# EAGLE design M606A (EAGLE 6.6.0)
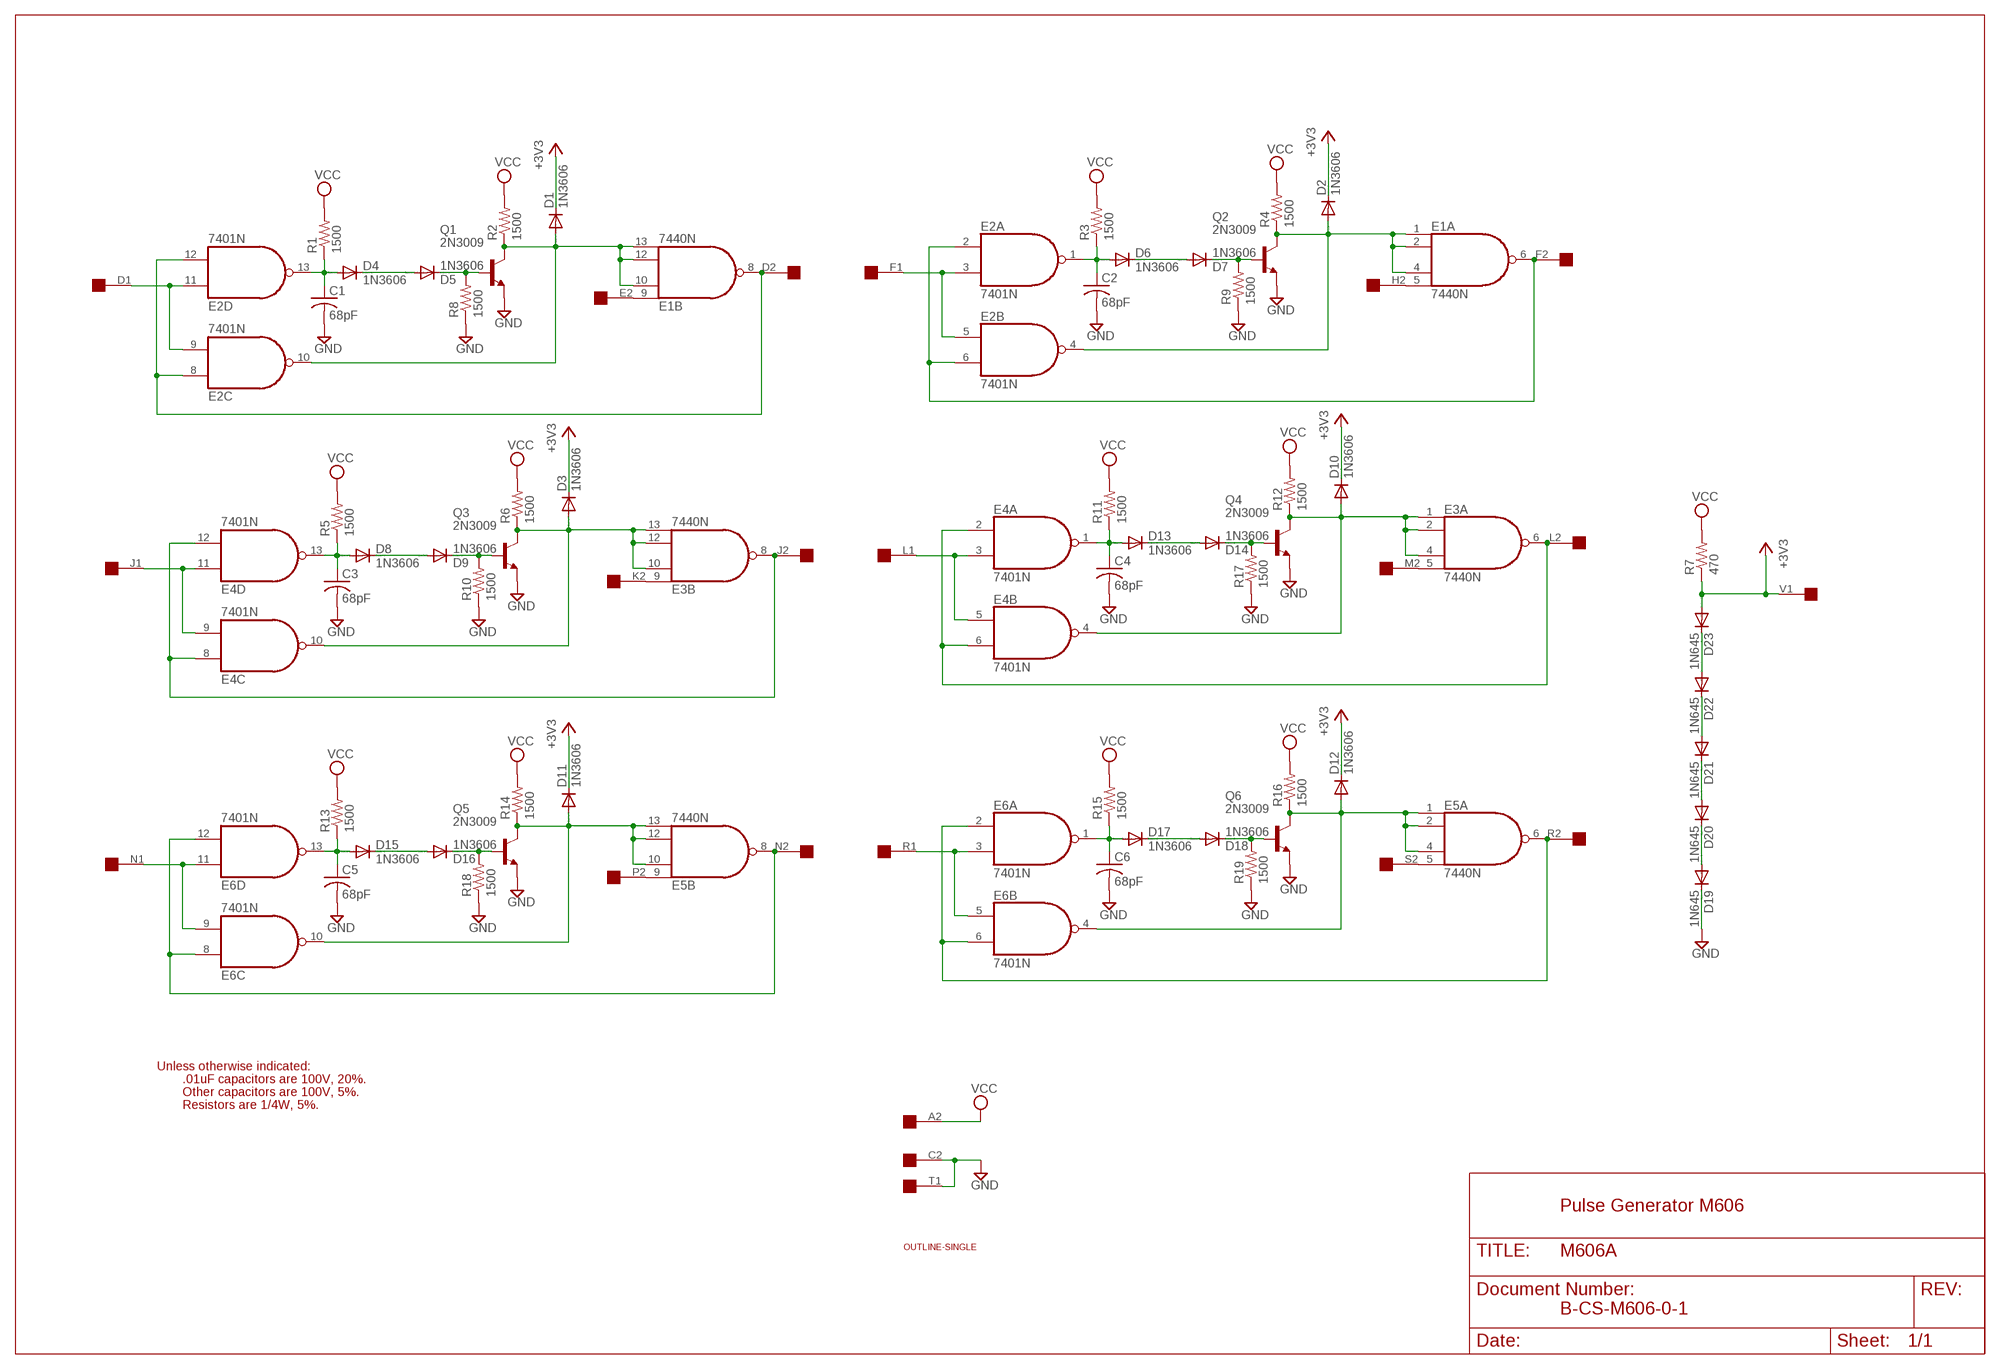
[diagram p0: schematic, sheet 1]

## Parts
C1  68pF  C-US075-032X103  [C075-032X103]
C2  68pF  C-US075-032X103  [C075-032X103]
C3  68pF  C-US075-032X103  [C075-032X103]
C4  68pF  C-US075-032X103  [C075-032X103]
C5  68pF  C-US075-032X103  [C075-032X103]
C6  68pF  C-US075-032X103  [C075-032X103]
D1  1N3606  1N4148DO35-10  [DO35-10]
D2  1N3606  1N4148DO35-10  [DO35-10]
D3  1N3606  1N4148DO35-10  [DO35-10]
D4  1N3606  1N4148DO35-10  [DO35-10]
D5  1N3606  1N4148DO35-10  [DO35-10]
D6  1N3606  1N4148DO35-10  [DO35-10]
D7  1N3606  1N4148DO35-10  [DO35-10]
D8  1N3606  1N4148DO35-10  [DO35-10]
D9  1N3606  1N4148DO35-10  [DO35-10]
D10  1N3606  1N4148DO35-10  [DO35-10]
D11  1N3606  1N4148DO35-10  [DO35-10]
D12  1N3606  1N4148DO35-10  [DO35-10]
D13  1N3606  1N4148DO35-10  [DO35-10]
D14  1N3606  1N4148DO35-10  [DO35-10]
D15  1N3606  1N4148DO35-10  [DO35-10]
D16  1N3606  1N4148DO35-10  [DO35-10]
D17  1N3606  1N4148DO35-10  [DO35-10]
D18  1N3606  1N4148DO35-10  [DO35-10]
D19  1N645  1N4148DO35-10  [DO35-10]
D20  1N645  1N4148DO35-10  [DO35-10]
D21  1N645  1N4148DO35-10  [DO35-10]
D22  1N645  1N4148DO35-10  [DO35-10]
D23  1N645  1N4148DO35-10  [DO35-10]
E1  7440N  74S20N  [DIL14]
E2  7401N  74LS01N  [DIL14]
E3  7440N  74S20N  [DIL14]
E4  7401N  74LS01N  [DIL14]
E5  7440N  74S20N  [DIL14]
E6  7401N  74LS01N  [DIL14]
Q1  2N3009  2N3019  [TO39]
Q2  2N3009  2N3019  [TO39]
Q3  2N3009  2N3019  [TO39]
Q4  2N3009  2N3019  [TO39]
Q5  2N3009  2N3019  [TO39]
Q6  2N3009  2N3019  [TO39]
R1  1500  R-US_0207/10  [0207/10]
R2  1500  R-US_0207/10  [0207/10]
R3  1500  R-US_0207/10  [0207/10]
R4  1500  R-US_0207/10  [0207/10]
R5  1500  R-US_0207/10  [0207/10]
R6  1500  R-US_0207/10  [0207/10]
R7  470  R-US_0207/10  [0207/10]
R8  1500  R-US_0207/10  [0207/10]
R9  1500  R-US_0207/10  [0207/10]
R10  1500  R-US_0207/10  [0207/10]
R11  1500  R-US_0207/10  [0207/10]
R12  1500  R-US_0207/10  [0207/10]
R13  1500  R-US_0207/10  [0207/10]
R14  1500  R-US_0207/10  [0207/10]
R15  1500  R-US_0207/10  [0207/10]
R16  1500  R-US_0207/10  [0207/10]
R17  1500  R-US_0207/10  [0207/10]
R18  1500  R-US_0207/10  [0207/10]
R19  1500  R-US_0207/10  [0207/10]
U$2  SINGLE  [EDGE-CON2]
U$4  OUTLINE-SINGLE  [SINGLE]

## Nets
+3V3 [Supply]: D1.C D2.C D3.C D10.C D11.C D12.C D23.A R7.1 U$2.V1
GND [Supply]: C1.2 C2.2 C3.2 C4.2 C5.2 C6.2 D19.C Q1.1(E) Q2.1(E) Q3.1(E) Q4.1(E) Q5.1(E) Q6.1(E) R8.1 R9.1 R10.1 R17.1 R18.1 R19.1 U$2.C2 U$2.T1
N$1: D4.C D5.A
N$2: D1.A E1.10(B:I1) E1.12(B:I2) E1.13(B:I3) E2.10(C:O) Q1.3(C) R2.1
N$3: D5.C Q1.2(B) R8.2
N$4: D6.C D7.A
N$5: D8.C D9.A
N$6: E1.9(B:I0) U$2.E2
N$7: E1.8(B:O) E2.8(C:I0) E2.12(D:I1) U$2.D2
N$8: E2.9(C:I1) E2.11(D:I0) U$2.D1
N$9: C1.1 D4.A E2.13(D:O) R1.1
N$10: D15.C D16.A
N$11: E2.3(A:I1) E2.5(B:I0) U$2.F1
N$12: C2.1 D6.A E2.1(A:O) R3.1
N$14: D7.C Q2.2(B) R9.2
N$15: D2.A E1.1(A:I0) E1.2(A:I1) E1.4(A:I2) E2.4(B:O) Q2.3(C) R4.1
N$16: E6.9(C:I1) E6.11(D:I0) U$2.N1
N$17: E4.9(C:I1) E4.11(D:I0) U$2.J1
N$18: C3.1 D8.A E4.13(D:O) R5.1
N$19: D9.C Q3.2(B) R10.2
N$20: D3.A E3.10(B:I1) E3.12(B:I2) E3.13(B:I3) E4.10(C:O) Q3.3(C) R6.1
N$21: D13.C D14.A
N$22: E4.3(A:I1) E4.5(B:I0) U$2.L1
N$23: C4.1 D13.A E4.1(A:O) R11.1
N$24: D14.C Q4.2(B) R17.2
N$25: D10.A E3.1(A:I0) E3.2(A:I1) E3.4(A:I2) E4.4(B:O) Q4.3(C) R12.1
N$26: C5.1 D15.A E6.13(D:O) R13.1
N$27: D16.C Q5.2(B) R18.2
N$28: D11.A E5.10(B:I1) E5.12(B:I2) E5.13(B:I3) E6.10(C:O) Q5.3(C) R14.1
N$29: D17.C D18.A
N$30: E6.3(A:I1) E6.5(B:I0) U$2.R1
N$31: C6.1 D17.A E6.1(A:O) R15.1
N$32: D18.C Q6.2(B) R19.2
N$33: D12.A E5.1(A:I0) E5.2(A:I1) E5.4(A:I2) E6.4(B:O) Q6.3(C) R16.1
N$34: E1.5(A:I3) U$2.H2
N$35: E1.6(A:O) E2.2(A:I0) E2.6(B:I1) U$2.F2
N$36: E3.8(B:O) E4.8(C:I0) E4.12(D:I1) U$2.J2
N$37: E3.9(B:I0) U$2.K2
N$38: E3.6(A:O) E4.2(A:I0) E4.6(B:I1) U$2.L2
N$39: E3.5(A:I3) U$2.M2
N$40: E5.8(B:O) E6.8(C:I0) E6.12(D:I1) U$2.N2
N$41: E5.9(B:I0) U$2.P2
N$42: E5.6(A:O) E6.2(A:I0) E6.6(B:I1) U$2.R2
N$43: E5.5(A:I3) U$2.S2
N$45: D22.A D23.C
N$46: D21.A D22.C
N$47: D19.A D20.C
N$48: D20.A D21.C
VCC [Supply]: R1.2 R2.2 R3.2 R4.2 R5.2 R6.2 R7.2 R11.2 R12.2 R13.2 R14.2 R15.2 R16.2 U$2.A2
Unconnected: U$2.A1 U$2.B1 U$2.B2 U$2.C1 U$2.E1 U$2.H1 U$2.K1 U$2.M1 U$2.P1 U$2.S1 U$2.T2 U$2.U1 U$2.U2 U$2.V2

## Notes on the sheet
- Unless otherwise indicated:
- .01uF capacitors are 100V, 20%.
- Other capacitors are 100V, 5%.
- Resistors are 1/4W, 5%.
- Pulse Generator M606
- B-CS-M606-0-1

## Power pins joined to a net without a drawn wire
GND: E1.7(P:GND) E2.7(P:GND) E3.7(P:GND) E4.7(P:GND) E5.7(P:GND) E6.7(P:GND)
VCC: E1.14(P:VCC) E2.14(P:VCC) E3.14(P:VCC) E4.14(P:VCC) E5.14(P:VCC) E6.14(P:VCC)

## Library data of the parts
C1-C6 = rcl:C-US: CAPACITOR, American symbol
D1-D23 = diode:1N4148: DIODE high speed (Philips)
E1 E3 E5 = 74xx-us:74*20: Dual 4-input NAND gate
E2 E4 E6 = 74xx-us:74*01: Quad 2-input NAND gate, open collector
Q1-Q6 = transistor-npn:2N3019: NPN Transistor
R1-R19 = rcl:R-US_: RESISTOR, American symbol
U$2 = dec-con:SINGLE: Single-Height DEC board
U$4 = dec-con:OUTLINE-*: Board outlines for DEC boards.

## Net classes
1 Supply: width 0.813 mm

## Board
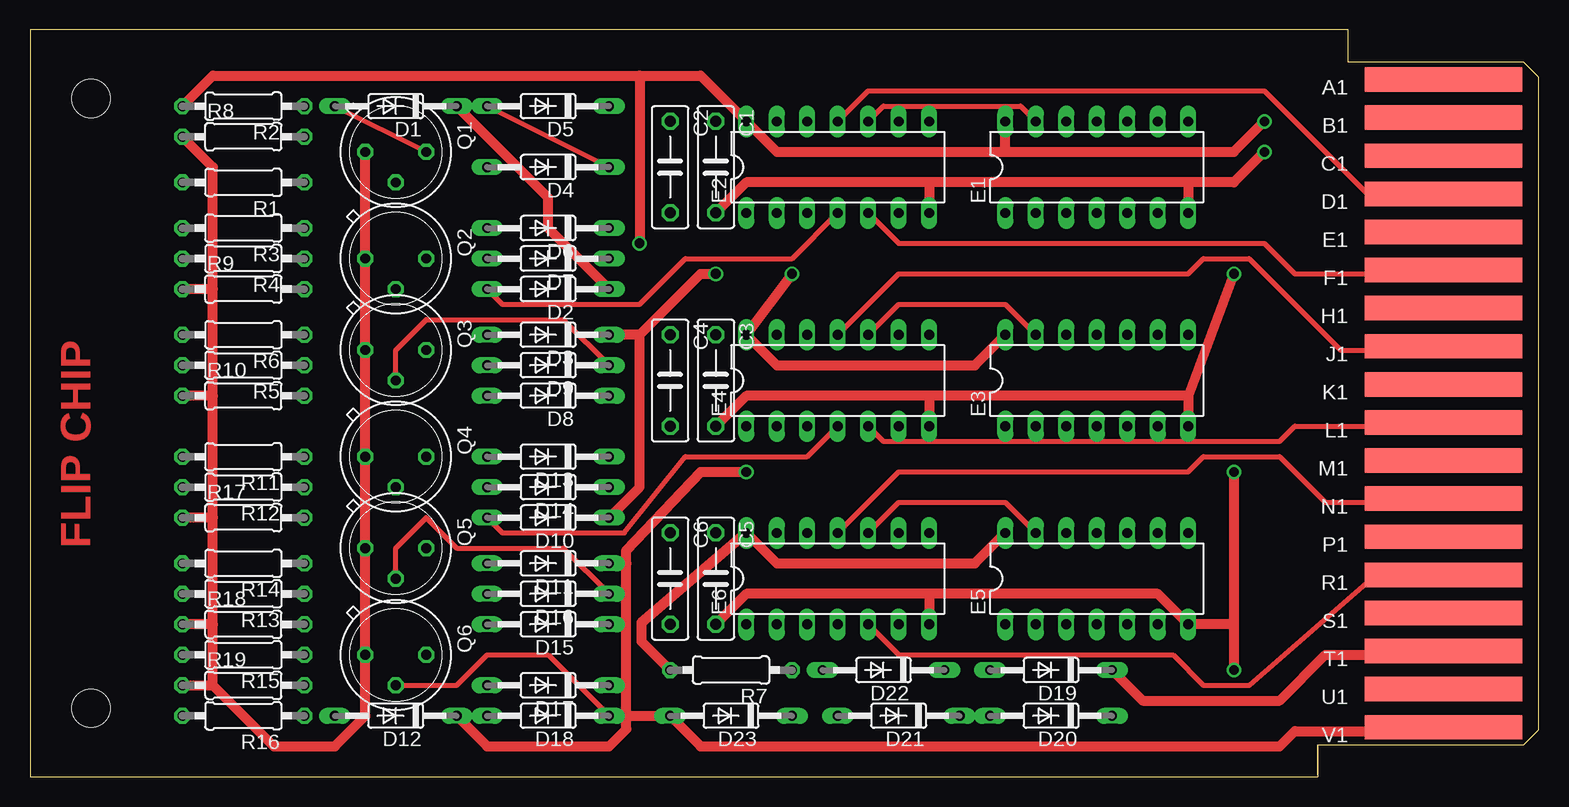
[diagram p1: board, top side]
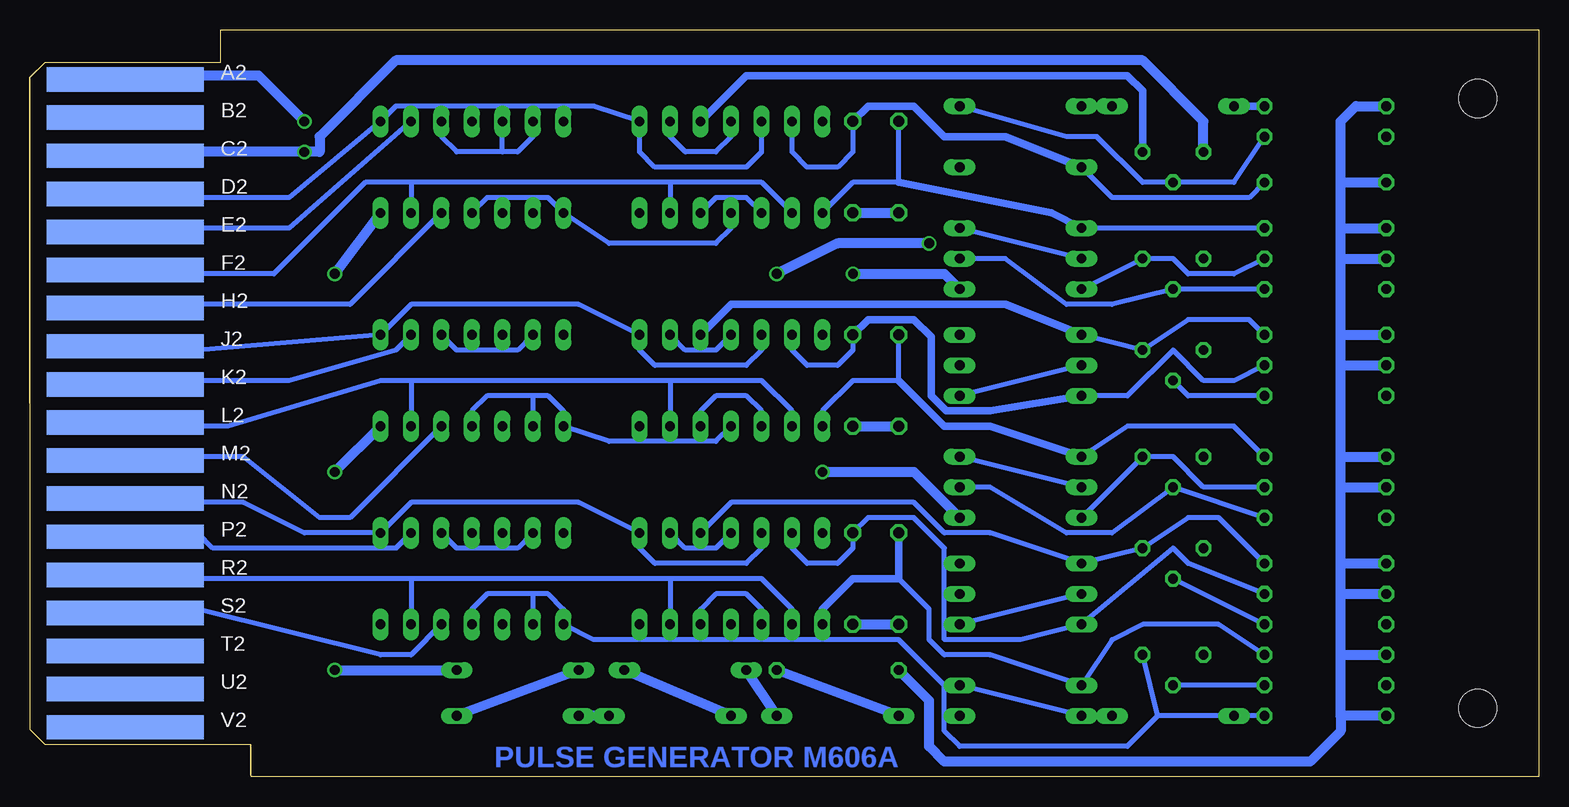
[diagram p2: board, bottom side, seen from below]

Size 125.73 x 62.23 mm. Coordinates in mm from the lower left corner, seen from the top.
Copper layers (1+16): Top 0.035mm / dielectric 1.5mm / Bottom 0.035mm
Design rules "16mils": minimum track width 16mil, minimum drill 32mil, track to track 15mil, track to pad 10mil, pad to pad 10mil, via to via 10mil, smd to smd 10mil, copper to edge 13mil, drill to drill 10mil, minimum pad ring 10mil, minimum via ring 8mil, stop-mask expansion 0mil, vias tented up to drill 0mil, thermal gap 10mil

### Footprints (pad centres in the part's own frame; a part is rotated, then mirrored left to right if it is on the bottom)
C075-032X103 = drill 0.914 octagon: 1 -3.81,0; 2 3.81,0
DO35-10 = drill 0.813 long: A 5.08,0; C -5.08,0
DIL14 = drill 0.813 long: 1 -7.62,-3.81; 2 -5.08,-3.81; 3 -2.54,-3.81; 4 0,-3.81; 5 2.54,-3.81; 6 5.08,-3.81; 7 7.62,-3.81; 8 7.62,3.81; 9 5.08,3.81; 10 2.54,3.81; 11 0,3.81; 12 -2.54,3.81; 13 -5.08,3.81; 14 -7.62,3.81
TO39 = drill 0.813 octagon: 1 0,-2.54; 2 2.54,0; 3 0,2.54
0207/10 = drill 0.813 octagon: 1 -5.08,0; 2 5.08,0
EDGE-CON2 = smd 13.106 x 2.032: A1 7.938,4.128; B1 7.938,7.303; C1 7.938,10.477; D1 7.938,13.652; E1 7.938,16.828; F1 7.938,20.003; H1 7.938,23.177; J1 7.938,26.352; K1 7.938,29.527; L1 7.938,32.703; M1 7.938,35.877; N1 7.938,39.053; P1 7.938,42.227; R1 7.938,45.403; S1 7.938,48.578; T1 7.938,51.752; U1 7.938,54.928; V1 7.938,58.102 | smd 13.106 x 2.032 bottom: A2 7.938,4.128; B2 7.938,7.303; C2 7.938,10.477; D2 7.938,13.652; E2 7.938,16.828; F2 7.938,20.003; H2 7.938,23.177; J2 7.938,26.352; K2 7.938,29.527; L2 7.938,32.703; M2 7.938,35.877; N2 7.938,39.053; P2 7.938,42.227; R2 7.938,45.403; S2 7.938,48.578; T2 7.938,51.752; U2 7.938,54.928; V2 7.938,58.102
SINGLE = hole 3.175: 120.65,56.515; 120.65,5.715

### Placement (x,y rotation side)
C1  57.15,50.8 270 top
C2  53.34,50.8 270 top
C3  57.15,33.02 270 top
C4  53.34,33.02 270 top
C5  57.15,16.51 270 top
C6  53.34,16.51 270 top
D1  30.48,55.88 180 top
D2  43.18,40.64 180 top
D3  43.18,36.83 180 top
D4  43.18,50.8 180 top
D5  43.18,55.88 180 top
D6  43.18,45.72 180 top
D7  43.18,43.18 180 top
D8  43.18,31.75 180 top
D9  43.18,34.29 180 top
D10  43.18,21.59 180 top
D11  43.18,17.78 180 top
D12  30.48,5.08 180 top
D13  43.18,26.67 180 top
D14  43.18,24.13 180 top
D15  43.18,12.7 180 top
D16  43.18,15.24 180 top
D17  43.18,7.62 180 top
D18  43.18,5.08 180 top
D19  85.09,8.89 180 top
D20  85.09,5.08 180 top
D21  72.39,5.08 180 top
D22  71.12,8.89 180 top
D23  58.42,5.08 180 top
E1  88.9,50.8 0 top
E2  67.31,50.8 0 top
E3  88.9,33.02 0 top
E4  67.31,33.02 0 top
E5  88.9,16.51 0 top
E6  67.31,16.51 0 top
Q1  30.48,52.07 270 top
Q2  30.48,43.18 270 top
Q3  30.48,35.56 270 top
Q4  30.48,26.67 270 top
Q5  30.48,19.05 270 top
Q6  30.48,10.16 270 top
R1  17.78,49.53 180 top
R2  17.78,55.88 180 top
R3  17.78,45.72 180 top
R4  17.78,43.18 180 top
R5  17.78,34.29 180 top
R6  17.78,36.83 180 top
R7  58.42,8.89 180 top
R8  17.78,53.34 0 top
R9  17.78,40.64 0 top
R10  17.78,31.75 0 top
R11  17.78,26.67 180 top
R12  17.78,24.13 180 top
R13  17.78,15.24 180 top
R14  17.78,17.78 180 top
R15  17.78,10.16 180 top
R16  17.78,5.08 180 top
R17  17.78,21.59 0 top
R18  17.78,12.7 0 top
R19  17.78,7.62 0 top
U$1  [FLIPCHIP]  0,0 0 top
U$2  125.73,62.23 180 top
U$4  125.73,62.23 180 top

### Tracks (layer width: path | path; a pad name or v marks a point on that pad's centre or on a via)
+3V3  (via drill 0.81)
  Top 0.813: U$2.V1 116.84,3.81 105.41,3.81 104.14,2.54 55.88,2.54 D23.A 49.69,5.08 49.69,3.97 | 49.69,17.78 D11.C | 49.69,3.97 49.69,17.78 | 49.69,3.97 48.26,2.54 38.1,2.54 D12.C | 49.69,17.78 49.69,18.89 55.88,25.4 v59.69,25.4 | D10.C 50.8,24.13 50.8,36.83 | 50.8,36.83 D3.C | 50.8,36.83 55.88,41.91 v57.15,41.91 | D1.C 43.18,48.26 43.18,45.72 D2.C
  Bottom 0.813: D23.A R7.1 | D10.C 52.07,25.4 v59.69,25.4 | D2.C 49.53,41.91 v57.15,41.91
GND  (via drill 0.81)
  Top 0.813: v102.87,52.07 100.33,49.53 96.52,49.53 | 74.93,49.53 59.69,49.53 C1.2 | 96.52,49.53 74.93,49.53 | 74.93,49.53 E2.7 | Q1.1 Q2.1 Q3.1 Q4.1 Q5.1 Q6.1 27.94,5.08 25.4,2.54 20.32,2.54 15.24,7.62 | 96.52,49.53 E1.7 | 100.33,12.7 v100.33,8.89 | 100.33,12.7 E5.7 93.98,15.24 74.93,15.24 | U$2.T1 116.84,10.16 107.95,10.16 104.14,6.35 92.71,6.35 D19.C | v100.33,25.4 100.33,12.7 | v100.33,41.91 96.52,31.75 | 74.93,15.24 59.69,15.24 C5.2 | 74.93,15.24 E6.7 | 74.93,31.75 59.69,31.75 C3.2 | 74.93,31.75 E4.7 | 96.52,31.75 74.93,31.75 | 96.52,31.75 E3.7 | R8.1 15.24,50.8 15.24,40.64 | 15.24,40.64 R9.1 | 15.24,31.75 R10.1 | 15.24,31.75 15.24,40.64 | 15.24,21.59 R17.1 | 15.24,21.59 15.24,31.75 | R19.1 15.24,7.62 | 15.24,7.62 15.24,12.7 | 15.24,12.7 15.24,21.59 | 15.24,12.7 R18.1
  Bottom 0.813: U$2.C2 117.17,51.74 116.84,52.07 v102.87,52.07 101.6,52.07 101.6,53.34 95.25,59.69 33.02,59.69 27.94,54.61 Q1.1 | C1.2 C2.2 | v100.33,8.89 D19.C | E1.7 v100.33,41.91 | E3.7 v100.33,25.4 | C3.2 C4.2 | C5.2 C6.2
N$1
  Top 0.406: D5.A D4.C
N$2
  Top 0.406: E2.10 71.12,55.88 82.55,55.88 E1.13 | D1.A Q1.3
  Bottom 0.406: 86.36,52.07 E1.12 | 86.36,52.07 90.17,52.07 91.44,53.34 E1.10 | E1.13 83.82,53.34 85.09,52.07 86.36,52.07
  Bottom 0.61: E2.10 66.04,58.42 34.29,58.42 33.02,57.15 Q1.3 | R2.1 D1.A
N$3
  Bottom 0.406: R8.2 25.4,49.53 Q1.2 33.02,49.53 36.83,53.34 39.37,53.34 D5.C
N$4
  Bottom 0.406: D7.A D6.C
N$5
  Bottom 0.406: D9.A D8.C
N$6
  Bottom 0.406: U$2.E2 116.84,45.72 105.41,45.72 104.14,45.72 E1.9
N$7
  Bottom 0.406: E2.12 64.77,52.07 66.04,50.8 73.66,50.8 74.93,52.07 E2.8 78.74,55.88 95.25,55.88 E1.8 104.14,48.26 116.84,48.26 U$2.D2
N$8
  Top 0.406: E2.11 69.85,57.15 102.87,57.15 111.76,48.26 116.84,48.26 U$2.D1
  Bottom 0.406: E2.11 67.31,53.34 68.58,52.07 71.12,52.07 72.39,53.34 E2.9
N$9
  Bottom 0.406: E2.13 62.23,52.07 60.96,50.8 58.42,50.8 57.15,52.07 C1.1 | R1.1 24.13,48.26 35.56,48.26 D4.A
  Bottom 0.61: C1.1 55.88,55.88 52.07,55.88 49.53,53.34 44.45,53.34 D4.A
N$10
  Bottom 0.406: D16.A D15.C
N$11
  Top 0.406: U$2.F1 116.84,41.91 105.41,41.91 102.87,44.45 72.39,44.45 E2.5
  Bottom 0.406: E2.3 66.04,48.26 68.58,48.26 E2.5
N$12
  Bottom 0.406: C2.1 53.34,49.53 57.15,49.53 E2.1 | R3.1 D6.A
  Bottom 0.61: 53.34,49.53 40.64,46.99 D6.A
N$14
  Bottom 0.406: D7.C 44.45,43.18 39.37,39.37 35.56,39.37 Q2.2 R9.2
N$15
  Top 0.406: E2.4 63.5,43.18 54.61,43.18 50.8,39.37 39.37,39.37 D2.A
  Bottom 0.406: 83.82,48.26 82.55,48.26 E1.1 77.47,44.45 68.58,44.45 67.31,45.72 E2.4 | 83.82,48.26 E1.2 | E1.4 87.63,48.26 83.82,48.26 | R4.1 25.4,41.91 29.21,41.91 30.48,43.18 Q2.3 D2.A
N$16
  Top 0.406: U$2.N1 116.84,22.86 107.95,22.86 104.14,26.67 97.79,26.67 96.52,25.4 72.39,25.4 E6.11
  Bottom 0.406: E6.9 71.12,19.05 68.58,19.05 E6.11
N$17
  Top 0.406: U$2.J1 116.84,35.56 109.22,35.56 101.6,43.18 97.79,43.18 96.52,41.91 72.39,41.91 E4.11
  Bottom 0.406: E4.9 71.12,35.56 68.58,35.56 E4.11
N$18
  Bottom 0.406: E4.13 62.23,35.56 60.96,34.29 58.42,34.29 57.15,35.56 C3.1 | R5.1 25.4,33.02 27.94,33.02 30.48,35.56 34.29,31.75 D8.A
  Bottom 0.61: C3.1 55.88,38.1 52.07,38.1 50.64,36.67 50.64,31.75 49.37,30.48 45.72,30.48 D8.A
N$19
  Top 0.406: D9.C 44.45,38.1 33.02,38.1 30.48,35.56 Q3.2
  Bottom 0.406: R10.2 29.21,31.75 Q3.2
N$20
  Top 0.406: E4.10 72.39,39.37 81.28,39.37 E3.13
  Bottom 0.406: E3.13 85.09,35.56 86.36,35.56 | 86.36,35.56 90.17,35.56 E3.10 | 86.36,35.56 E3.12 | D3.A Q3.3 29.21,38.1 24.13,38.1 R6.1
  Bottom 0.61: E4.10 67.31,39.37 44.45,39.37 D3.A
N$21
  Bottom 0.406: D14.A D13.C
N$22
  Top 0.406: U$2.L1 116.84,29.21 105.41,29.21 104.14,27.94 71.12,27.94 E4.5
  Bottom 0.406: E4.3 64.77,30.48 66.04,31.75 68.58,31.75 69.85,30.48 E4.5
N$23
  Bottom 0.406: C4.1 53.34,33.02 57.15,33.02 59.69,30.48 E4.1 | R11.1 25.4,29.21 34.29,29.21 D13.A
  Bottom 0.61: D13.A 45.72,29.21 49.53,29.21 53.34,33.02
N$24
  Bottom 0.406: R17.2 Q4.2 35.56,20.32 39.37,20.32 45.72,24.13 D14.C
N$25
  Top 0.406: E4.4 64.77,26.67 54.61,26.67 49.53,20.32 39.37,20.32 D10.A
  Bottom 0.406: 83.82,31.75 82.55,31.75 81.28,30.48 E3.1 77.47,27.94 68.58,27.94 E4.4 | 83.82,31.75 87.63,31.75 88.9,30.48 E3.4 | 83.82,31.75 E3.2 | R12.1 27.94,24.13 30.48,26.67 Q4.3 D10.A
N$26
  Bottom 0.406: E6.13 62.23,19.05 60.96,17.78 58.42,17.78 57.15,19.05 C5.1 55.88,21.59 52.07,21.59 49.53,19.05 49.53,11.43 43.18,11.43 D15.A 30.48,19.05 29.21,17.78 R13.1
N$27
  Top 0.406: Q5.2 30.48,19.05 33.02,21.59 35.56,19.05 44.45,19.05 D16.C
  Bottom 0.406: R18.2 Q5.2
N$28
  Top 0.406: E6.10 72.39,22.86 81.28,22.86 E5.13
  Bottom 0.406: E5.13 85.09,19.05 86.36,19.05 | 86.36,19.05 E5.12 | E5.10 90.17,19.05 86.36,19.05 | E6.10 67.31,22.86 52.07,22.86 49.53,20.32 45.72,20.32 D11.A Q5.3 29.21,21.59 26.67,21.59 R14.1
N$29
  Bottom 0.406: D18.A D17.C
N$30
  Top 0.406: U$2.R1 116.84,16.51 111.76,16.51 101.6,7.62 97.79,7.62 95.25,10.16 72.39,10.16 E6.5
  Bottom 0.406: E6.3 64.77,13.97 66.04,15.24 68.58,15.24 69.85,13.97 E6.5
N$31
  Bottom 0.406: 53.34,16.51 50.8,13.97 50.8,11.43 49.53,10.16 45.72,10.16 D17.A 35.56,11.43 33.02,12.7 26.67,12.7 R15.1
  Bottom 0.61: C6.1 53.34,16.51 57.15,16.51 59.69,13.97 E6.1
N$32
  Top 0.406: Q6.2 35.56,7.62 38.1,10.16 43.18,10.16 D18.C
  Bottom 0.406: R19.2 Q6.2
N$33
  Bottom 0.406: 83.82,15.24 82.55,15.24 81.28,13.97 E5.1 78.74,11.43 67.31,11.43 | 83.82,15.24 87.63,15.24 88.9,13.97 E5.4 | 83.82,15.24 E5.2 | 67.31,11.43 E6.4 | 67.31,11.43 53.34,11.43 49.53,7.62 49.53,3.81 48.26,2.54 34.29,2.54 31.75,5.08 | R16.1 D12.A 31.75,5.08 | 31.75,5.08 Q6.3
N$34
  Bottom 0.406: U$2.H2 115.57,39.37 99.06,39.37 E1.5
N$35
  Bottom 0.406: E2.2 64.77,49.53 72.39,49.53 | 72.39,49.53 E2.6 | 93.98,49.53 E1.6 | 72.39,49.53 93.98,49.53 | U$2.F2 116.84,41.91 105.41,41.91 97.79,49.53 93.98,49.53
N$36
  Bottom 0.406: E4.12 64.77,35.56 66.04,34.29 73.66,34.29 74.93,35.56 E4.8 80.01,39.37 93.98,39.37 E3.8 111.76,35.56 116.84,35.56 U$2.J2
N$37
  Bottom 0.406: U$2.K2 116.84,33.02 104.14,33.02 95.25,35.56 E3.9
N$38
  Bottom 0.406: E4.2 62.23,30.48 64.77,33.02 72.39,33.02 | 72.39,33.02 E4.6 | 93.98,33.02 E3.6 | 72.39,33.02 93.98,33.02 | 93.98,33.02 96.52,33.02 109.22,29.21 116.84,29.21 U$2.L2
N$39
  Bottom 0.406: U$2.M2 116.84,26.67 107.95,26.67 101.6,21.59 99.06,21.59 E3.5
N$40
  Bottom 0.406: E6.12 64.77,19.05 66.04,17.78 73.66,17.78 74.93,19.05 E6.8 80.01,22.86 93.98,22.86 E5.8 102.87,20.32 107.95,22.86 116.84,22.86 U$2.N2
N$41
  Bottom 0.406: U$2.P2 116.84,20.32 111.76,20.32 110.49,19.05 95.25,19.05 E5.9
N$42
  Bottom 0.406: E6.2 62.23,13.97 64.77,16.51 72.39,16.51 | 72.39,16.51 E6.6 | 93.98,16.51 E5.6 | 72.39,16.51 93.98,16.51 | U$2.R2 116.84,16.51 93.98,16.51
N$43
  Bottom 0.406: U$2.S2 116.84,13.97 111.76,13.97 96.52,10.16 93.98,10.16 E5.5
N$45
  Bottom 0.813: D23.C D22.A
N$46
  Bottom 0.813: D21.A D22.C
N$47
  Bottom 0.813: D19.A D20.C
N$48
  Bottom 0.813: D21.C D20.A
VCC  (via drill 0.81)
  Top 0.813: v102.87,54.61 100.33,52.07 81.28,52.07 | 81.28,52.07 62.23,52.07 E2.14 55.88,58.42 50.8,58.42 | 81.28,52.07 E1.14 | E5.14 78.74,17.78 62.23,17.78 E6.14 50.96,12.86 50.96,11.27 R7.2 | E3.14 78.74,34.29 62.23,34.29 E4.14 v63.5,41.91 | 50.8,58.42 v50.8,44.45 | 50.8,58.42 15.24,58.42 R2.2
  Bottom 0.813: U$2.A2 117.24,58.02 116.84,58.42 106.68,58.42 v102.87,54.61 | v63.5,41.91 58.42,44.45 v50.8,44.45 | R2.2 15.24,55.88 16.51,54.61 16.51,49.53 | 16.51,49.53 R1.2 | 16.51,43.18 R4.2 | 16.51,43.18 16.51,45.72 | 16.51,45.72 16.51,49.53 | 16.51,45.72 R3.2 | 16.51,36.83 R6.2 | 16.51,36.83 16.51,43.18 | 16.51,34.29 R5.2 | 16.51,34.29 16.51,36.83 | 16.51,24.13 R12.2 | 16.51,24.13 16.51,26.67 | 16.51,26.67 16.51,34.29 | 16.51,26.67 R11.2 | 16.51,17.78 R14.2 | 16.51,17.78 16.51,24.13 | 16.51,15.24 R13.2 | 16.51,15.24 16.51,17.78 | 16.51,10.16 R15.2 | 16.51,10.16 16.51,15.24 | R16.2 16.51,5.08 | 16.51,5.08 16.51,10.16 | 16.51,5.08 16.51,3.81 19.05,1.27 49.53,1.27 50.8,2.54 50.8,6.35 R7.2

### Text on the board
Bottom: PULSE GENERATOR M606A